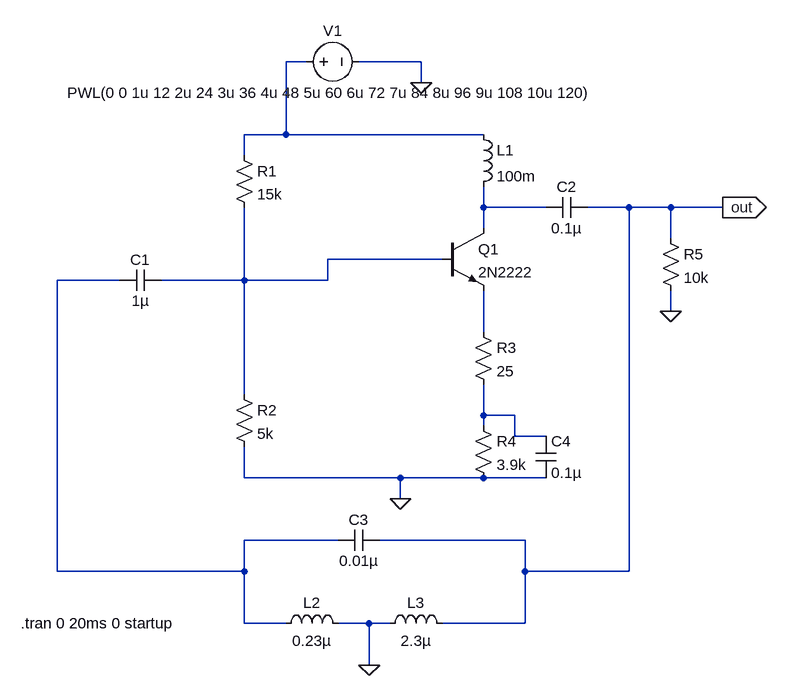
[diagram p0: schematic Hartley.asc]
Hartley.asc, the LTspice schematic file:
Version 4
SHEET 1 880 724
WIRE 48 -224 16 -224
WIRE 224 -224 128 -224
WIRE 224 -192 224 -224
WIRE 16 -112 16 -224
WIRE 16 -112 -48 -112
WIRE 320 -112 16 -112
WIRE -48 -80 -48 -112
WIRE 320 0 320 -32
WIRE 416 0 320 0
WIRE 544 0 480 0
WIRE 608 0 544 0
WIRE 688 0 608 0
WIRE 320 32 320 0
WIRE 608 48 608 0
WIRE 256 80 80 80
WIRE -240 112 -336 112
WIRE -48 112 -48 0
WIRE -48 112 -176 112
WIRE 80 112 80 80
WIRE 80 112 -48 112
WIRE 608 160 608 128
WIRE 320 192 320 128
WIRE -48 288 -48 112
WIRE 320 320 320 272
WIRE 368 320 320 320
WIRE 320 336 320 320
WIRE 368 352 368 320
WIRE 416 352 368 352
WIRE -48 416 -48 368
WIRE 192 416 -48 416
WIRE 320 416 192 416
WIRE 416 416 320 416
WIRE 192 448 192 416
WIRE 96 512 -48 512
WIRE 384 512 160 512
WIRE -336 560 -336 112
WIRE -48 560 -48 512
WIRE -48 560 -336 560
WIRE 384 560 384 512
WIRE 544 560 544 0
WIRE 544 560 384 560
WIRE -48 640 -48 560
WIRE 16 640 -48 640
WIRE 144 640 96 640
WIRE 176 640 144 640
WIRE 384 640 384 560
WIRE 384 640 256 640
WIRE 144 704 144 640
FLAG 608 160 0
FLAG 192 448 0
FLAG 144 704 0
FLAG 224 -192 0
FLAG 688 0 out
IOPIN 688 0 Out
SYMBOL npn 256 32 R0
SYMATTR InstName Q1
SYMATTR Value 2N2222
SYMBOL res -64 -96 R0
SYMATTR InstName R1
SYMATTR Value 15k
SYMBOL res -64 272 R0
SYMATTR InstName R2
SYMATTR Value 5k
SYMBOL res 304 176 R0
SYMATTR InstName R3
SYMATTR Value 25
SYMBOL res 304 320 R0
SYMATTR InstName R4
SYMATTR Value 3.9k
SYMBOL ind 304 -128 R0
SYMATTR InstName L1
SYMATTR Value 100m
SYMBOL ind 0 656 R270
WINDOW 0 32 56 VTop 2
WINDOW 3 5 56 VBottom 2
SYMATTR InstName L2
SYMATTR Value 0.23µ
SYMBOL ind 160 656 R270
WINDOW 0 32 56 VTop 2
WINDOW 3 5 56 VBottom 2
SYMATTR InstName L3
SYMATTR Value 2.3µ
SYMBOL cap -176 96 R90
WINDOW 0 0 32 VBottom 2
WINDOW 3 32 32 VTop 2
SYMATTR InstName C1
SYMATTR Value 1µ
SYMBOL cap 480 -16 R90
WINDOW 0 0 32 VBottom 2
WINDOW 3 32 32 VTop 2
SYMATTR InstName C2
SYMATTR Value 0.1µ
SYMBOL cap 160 496 R90
WINDOW 0 0 32 VBottom 2
WINDOW 3 32 32 VTop 2
SYMATTR InstName C3
SYMATTR Value 0.01µ
SYMBOL res 592 32 R0
SYMATTR InstName R5
SYMATTR Value 10k
SYMBOL cap 400 352 R0
SYMATTR InstName C4
SYMATTR Value 0.1µ
SYMBOL voltage 32 -224 R270
WINDOW 0 32 56 VTop 2
WINDOW 3 -32 56 VBottom 2
WINDOW 123 0 0 Left 0
WINDOW 39 0 0 Left 0
SYMATTR InstName V1
SYMATTR Value PWL(0 0 1u 12 2u 24 3u 36 4u 48 5u 60 6u 72 7u 84 8u 96 9u 108 10u 120)
TEXT -392 640 Left 2 !.tran 0 20ms 0 startup

The netlist it stands for:
* Hartley.asc
Q1 N002 N003 N005 0 2N2222
R1 N001 N003 15k
R2 N003 0 5k
R3 N005 N006 25
R4 N006 0 3.9k
L1 N001 N002 100m
L2 N004 0 0.23µ
L3 0 out 2.3µ
C1 N003 N004 1µ
C2 out N002 0.1µ
C3 out N004 0.01µ
R5 out 0 10k
C4 N006 0 0.1µ
V1 N001 0 PWL(0 0 1u 12 2u 24 3u 36 4u 48 5u 60 6u 72 7u 84 8u 96 9u 108 10u 120)
.model NPN NPN
.model PNP PNP
.lib standard.bjt
.tran 0 20ms 0 startup
.backanno
.end